# EAGLE schematic arduino_clock_source (EAGLE 9.0.1)
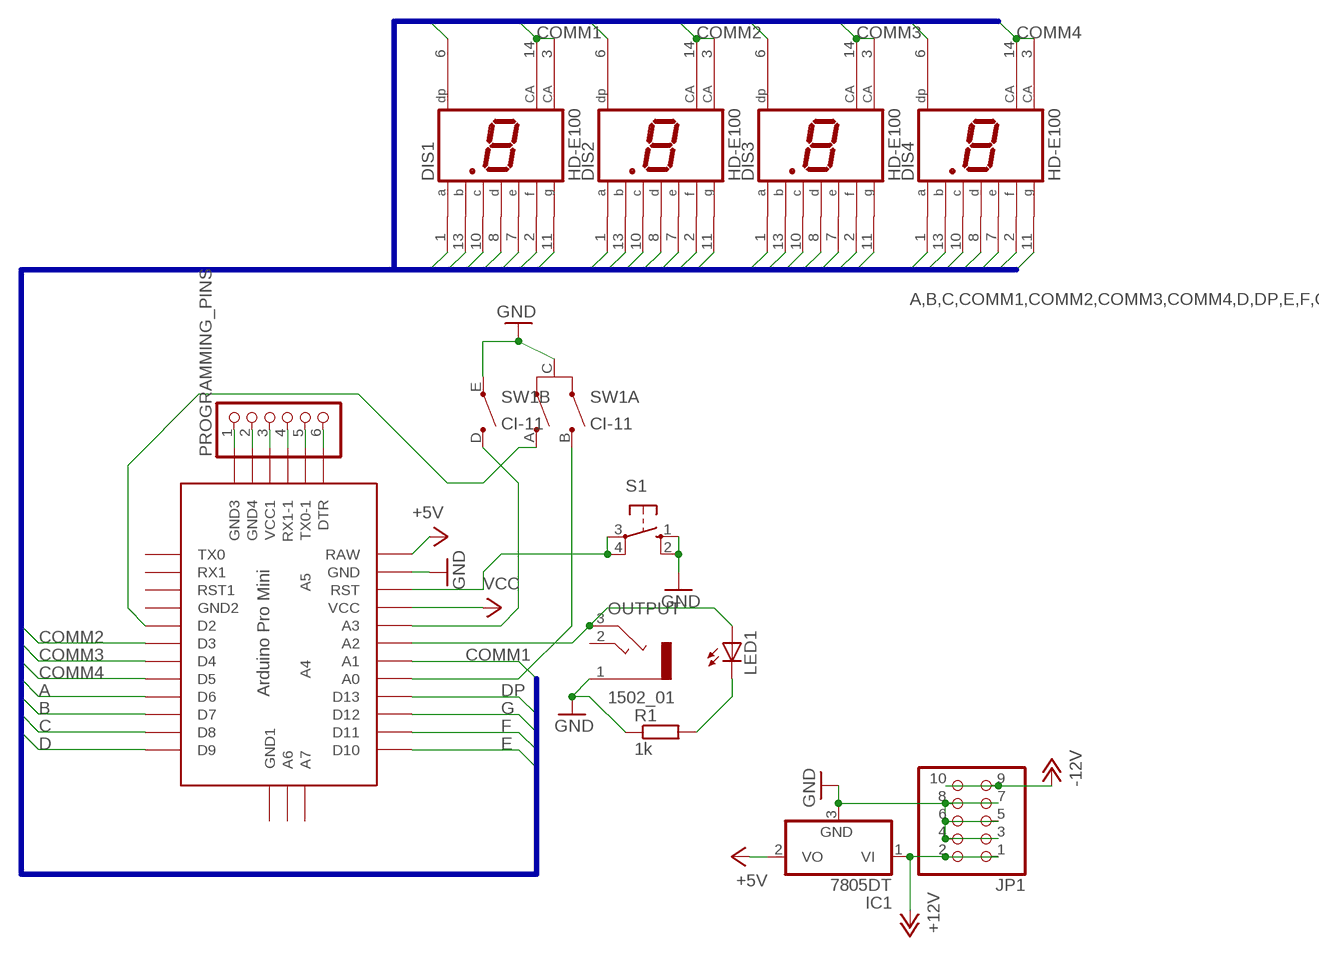
[diagram p0: schematic, sheet 1]

## Parts
DIS1  HD-E100  [HDSP-I]
DIS2  HD-E100  [HDSP-I]
DIS3  HD-E100  [HDSP-I]
DIS4  HD-E100  [HDSP-I]
IC1  7805DT  [TO252]
JP1  PINHD-2X5  [2X05]
LED1  LED5MM  [LED5MM]
OUTPUT  1502_01  [1502_01]
PROGRAMMING_PINS  PINHD-1X6  [1X06]
R1  1k  R-EU_0204/7  [0204/7]
S1  10-XX  [B3F-10XX]
SW1  CI-11  [CI-11]
U$1  ABK-PRO-MINI  [ABK-PRO-MINI]

## Nets
+5V: IC1.2(VO) U$1.RAW
+12V: IC1.1(VI) JP1.1 JP1.2
-12V: JP1.9 JP1.10
A: DIS1.1(A) DIS2.1(A) DIS3.1(A) DIS4.1(A) U$1.D6
B: DIS1.13(B) DIS2.13(B) DIS3.13(B) DIS4.13(B) U$1.D7
C: DIS1.10(C) DIS2.10(C) DIS3.10(C) DIS4.10(C) U$1.D8
COMM1: DIS1.3(CA) DIS1.14(CA) U$1.A1
COMM2: DIS2.3(CA) DIS2.14(CA) U$1.D3
COMM3: DIS3.3(CA) DIS3.14(CA) U$1.D4
COMM4: DIS4.3(CA) DIS4.14(CA) U$1.D5
D: DIS1.8(D) DIS2.8(D) DIS3.8(D) DIS4.8(D) U$1.D9
DP: DIS1.6(DP) DIS2.6(DP) DIS3.6(DP) DIS4.6(DP) U$1.D13
E: DIS1.7(E) DIS2.7(E) DIS3.7(E) DIS4.7(E) U$1.D10
F: DIS2.2(F) DIS3.2(F) DIS4.2(F) U$1.D11
G: DIS1.2(F) DIS2.11(G) DIS3.11(G) DIS4.11(G) U$1.D12
GND: IC1.3(GND) JP1.3 JP1.4 JP1.5 JP1.6 JP1.7 JP1.8 OUTPUT.1 R1.1 S1.1(S) S1.2(S1) SW1.C(A:C) SW1.E(B:E) U$1.GND
N$1: PROGRAMMING_PINS.1 U$1.GND2(GND3)
N$2: PROGRAMMING_PINS.2 U$1.GND3(GND4)
N$3: PROGRAMMING_PINS.3 U$1.VCC1
N$4: PROGRAMMING_PINS.4 U$1.RX1-1
N$5: PROGRAMMING_PINS.5 U$1.TX0-1
N$6: LED1.A OUTPUT.3 U$1.A2
N$7: PROGRAMMING_PINS.6 U$1.DTR
N$8: LED1.K(C) R1.2
N$9: SW1.B(A:B) U$1.A0
N$10: SW1.D(B:D) U$1.A3
N$11: SW1.A(A:A) U$1.D2
N$12: S1.3(P) S1.4(P1) U$1.RST
N$22: DIS1.11(G)
VCC: U$1.VCC
Unconnected: OUTPUT.2 U$1.A4 U$1.A5 U$1.A6 U$1.A7 U$1.GND1(GND2) U$1.GND4(GND1) U$1.RST1 U$1.RX1 U$1.TX0

## Buses
A,B,C,COMM1,COMM2,COMM3,COMM4,D,DP,E,F,G

## Library data of the parts
DIS1-DIS4 = display-hp:HD-E100: LED DISPLAY 1-character 7 segment, decimal point left; OC_FARNELL: unknown; OC_NEWARK: unknown
IC1 = linear:78*: Positive VOLTAGE REGULATOR Source: http://cache.national.com/ds/LM/LM78L05.pdf http://www.fairchildsemi.com/ds/LM/LM7805.pdf
JP1 = pinhead:PINHD-2X5: PIN HEADER
LED1 = led:LED: LED OSRAM: - CHIPLED LG R971, LG N971, LY N971, LG Q971, LY Q971, LO R971, LY R971 LH N974, LH R974 LS Q976, LO Q976, LY Q976 LO Q996 - Hyper CHIPLED LW Q18S LB Q993, LB Q99A, LB R99A - SideLED LS A670, LO A670, LY A670, LG A670, LP A670 LB A673, LV A673, LT A673, LW A673 LH A674 LY A675 LS A676, LA A676, LO A676, LY A676, LW A676 LS A679, LY A679, LG A679 - Hyper Micro SIDELED® LS Y876, LA Y876, LO Y876, LY Y876 LT Y87S - SmartLED LW L88C, LW L88S LB L89C, LB L89S, LG L890 LS L89K, LO L89K, LY L89K LS L896, LA L896, LO L896, LY L896 - TOPLED LS T670, LO T670, LY T670, LG T670, LP T670 LSG T670, LSP T670, LSY T670, LOP T670, LYG T670 LG T671, LOG T671, LSG T671 LB T673, LV T673, LT T673, LW T673 LH T674 LS T676, LA T676, LO T676, LY T676, LB T676, LH T676, LSB T676, LW T676 LB T67C, LV T67C, LT T67C, LS T67K, LO T67K, LY T67K, LW E67C LS E67B, LA E67B, LO E67B, LY E67B, LB E67C, LV E67C, LT E67C LW T67C LS T679, LY T679, LG T679 LS T770, LO T770, LY T770, LG T770, LP T770 LB T773, LV T773, LT T773, LW T773 LH T774 LS E675, LA E675, LY E675, LS T675 LS T776, LA T776, LO T776, LY T776, LB T776 LHGB T686 LT T68C, LB T68C - Hyper Mini TOPLED® LB M676 - Mini TOPLED Santana® LG M470 LS M47K, LO M47K, LY M47K Source: http://www.osram.convergy.de LUXEON: - LUMILED® LXK2-PW12-R00, LXK2-PW12-S00, LXK2-PW14-U00, LXK2-PW14-V00 LXK2-PM12-R00, LXK2-PM12-S00, LXK2-PM14-U00 LXK2-PE12-Q00, LXK2-PE12-R00, LXK2-PE12-S00, LXK2-PE14-T00, LXK2-PE14-U00 LXK2-PB12-K00, LXK2-PB12-L00, LXK2-PB12-M00, LXK2-PB14-N00, LXK2-PB14-P00, LXK2-PB14-Q00 LXK2-PR12-L00, LXK2-PR12-M00, LXK2-PR14-Q00, LXK2-PR14-R00 LXK2-PD12-Q00, LXK2-PD12-R00, LXK2-PD12-S00 LXK2-PH12-R00, LXK2-PH12-S00 LXK2-PL12-P00, LXK2-PL12-Q00, LXK2-PL12-R00 Source: www.luxeon.com KINGBRIGHT: KA-3528ASYC Source: www.kingbright.com
OUTPUT = con-lumberg:1502_01: Jack connectors according to JISC 6560, 3.5 mm Klinkensteckverbinder nach JISC 6560, 3,5 mm Source: http://www.lumberg.com/Produkte/PDFs/1502_01.pdf; OC_FARNELL: 4739747; OC_NEWARK: unknown
PROGRAMMING_PINS = pinhead:PINHD-1X6: PIN HEADER
R1 = resistor:R-EU_: RESISTOR, European symbol
S1 = switch-omron:10-XX: OMRON SWITCH; MPN: B3F-1000; OC_FARNELL: 176432; OC_NEWARK: 36M3542
SW1 = piher:CI-11: 11mm Incemental Encoder Source: www.piher.net .. 04-CI-11v04.pdf; OC_FARNELL: unknown; OC_NEWARK: unknown
U$1 = Arduino-clone:ABK-PRO-MINI: ABK Pro-Mini Arduino Clone